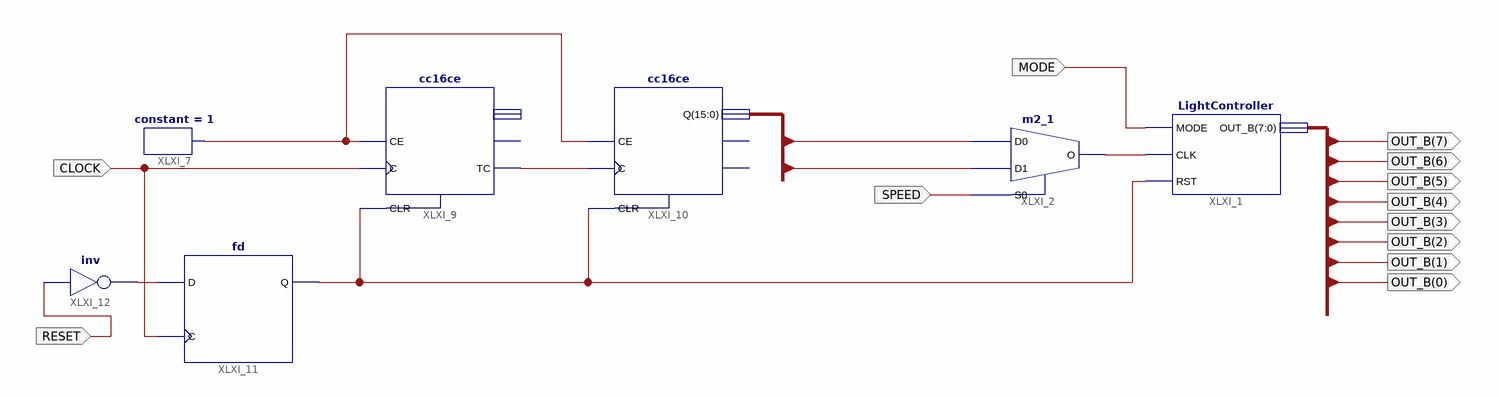
[diagram p0: schematic sheet 1]
// Xilinx ISE schematic TopLevel.sch (spartan3a) as structural Verilog: 7 symbols, 12 ports
module TopLevel (
  input  MODE,
  input  SPEED,
  input  CLOCK,
  input  RESET,
  output [7:0] OUT_B
);

  wire XLXN_10, XLXN_23, XLXN_25, XLXN_32, XLXN_52;
  wire [15:0] CNT_BUS;

  LightController XLXI_1 (.MODE(MODE), .CLK(XLXN_10), .RST(XLXN_23), .OUT_B(OUT_B));
  m2_1 XLXI_2 (.D0(CNT_BUS[5]), .D1(CNT_BUS[7]), .S0(SPEED), .O(XLXN_10));
  constant #(.CValue("1")) XLXI_7 (.O(XLXN_25));
  cc16ce XLXI_9 (.C(CLOCK), .CE(XLXN_25), .CLR(XLXN_23), .TC(XLXN_32));  // open: CEO, Q
  cc16ce XLXI_10 (.C(XLXN_32), .CE(XLXN_25), .CLR(XLXN_23), .Q(CNT_BUS));  // open: CEO, TC
  fd XLXI_11 (.C(CLOCK), .D(XLXN_52), .Q(XLXN_23));
  not XLXI_12 (XLXN_52, RESET);
endmodule
